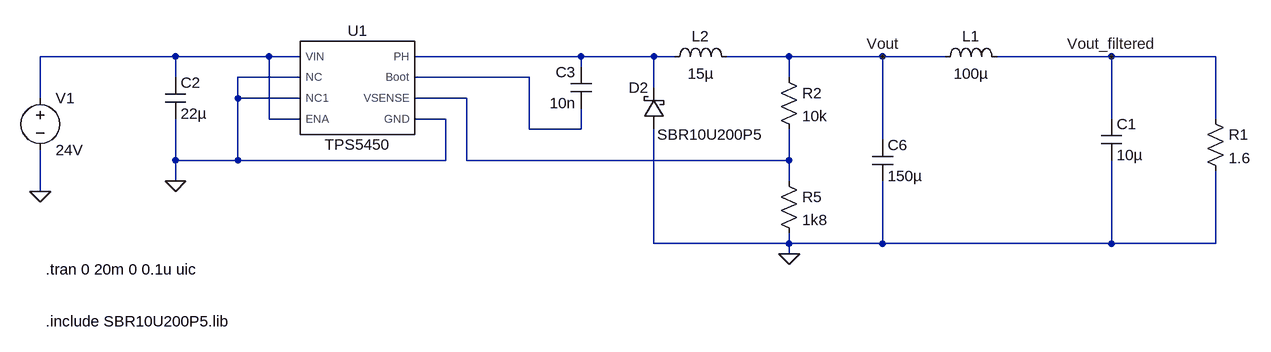
[diagram p0: schematic buck_24v_8v.asc]
buck_24v_8v.asc, the LTspice schematic file:
Version 4
SHEET 1 880 952
WIRE -1248 128 -1456 128
WIRE -1104 128 -1248 128
WIRE -1056 128 -1104 128
WIRE -624 128 -880 128
WIRE -512 128 -624 128
WIRE -480 128 -512 128
WIRE -304 128 -400 128
WIRE -160 128 -304 128
WIRE -64 128 -160 128
WIRE 192 128 16 128
WIRE 352 128 192 128
WIRE -624 144 -624 128
WIRE -1248 160 -1248 128
WIRE -1056 160 -1152 160
WIRE -704 160 -880 160
WIRE -304 160 -304 128
WIRE -512 176 -512 128
WIRE -1456 192 -1456 128
WIRE -1152 192 -1152 160
WIRE -1056 192 -1152 192
WIRE -800 192 -880 192
WIRE -1104 224 -1104 128
WIRE -1056 224 -1104 224
WIRE -832 224 -880 224
WIRE 192 224 192 128
WIRE 352 224 352 128
WIRE -704 240 -704 160
WIRE -624 240 -624 208
WIRE -624 240 -704 240
WIRE -160 256 -160 128
WIRE -1248 288 -1248 224
WIRE -1152 288 -1152 192
WIRE -1152 288 -1248 288
WIRE -832 288 -832 224
WIRE -832 288 -1152 288
WIRE -800 288 -800 192
WIRE -304 288 -304 240
WIRE -304 288 -800 288
WIRE -1248 320 -1248 288
WIRE -304 320 -304 288
WIRE -1456 336 -1456 272
WIRE -512 416 -512 240
WIRE -304 416 -304 400
WIRE -304 416 -512 416
WIRE -160 416 -160 320
WIRE -160 416 -304 416
WIRE 192 416 192 288
WIRE 192 416 -160 416
WIRE 352 416 352 304
WIRE 352 416 192 416
WIRE -304 432 -304 416
FLAG -1456 336 0
FLAG -1248 320 0
FLAG -304 432 0
FLAG -160 128 Vout
FLAG 192 128 Vout_filtered
SYMBOL voltage -1456 176 R0
WINDOW 123 0 0 Left 0
WINDOW 39 0 0 Left 0
SYMATTR InstName V1
SYMATTR Value 24V
SYMBOL cap -1264 160 R0
SYMATTR InstName C2
SYMATTR Value 22µ
SYMBOL cap -608 208 R180
WINDOW 0 24 56 Left 2
WINDOW 3 24 8 Left 2
SYMATTR InstName C3
SYMATTR Value 10n
SYMATTR SpiceLine Rser=78m
SYMBOL ind -496 144 R270
WINDOW 0 32 56 VTop 2
WINDOW 3 5 56 VBottom 2
SYMATTR InstName L2
SYMATTR Value 15µ
SYMATTR SpiceLine Rser=19m
SYMBOL res -320 144 R0
SYMATTR InstName R2
SYMATTR Value 10k
SYMBOL res -320 304 R0
SYMATTR InstName R5
SYMATTR Value 1k8
SYMBOL cap -176 256 R0
SYMATTR InstName C6
SYMATTR Value 150µ
SYMATTR SpiceLine Rser=35m
SYMBOL schottky -496 240 R180
WINDOW 0 24 64 Left 2
WINDOW 3 -152 -8 Left 2
SYMATTR InstName D2
SYMATTR Value SBR10U200P5
SYMATTR Description Diode
SYMATTR Type diode
SYMBOL TPS5450 -976 176 R0
SYMATTR InstName U1
SYMBOL res 336 208 R0
SYMATTR InstName R1
SYMATTR Value 1.6
SYMBOL ind -80 144 R270
WINDOW 0 32 56 VTop 2
WINDOW 3 5 56 VBottom 2
SYMATTR InstName L1
SYMATTR Value 100µ
SYMBOL cap 176 224 R0
SYMATTR InstName C1
SYMATTR Value 10µ
TEXT -1448 456 Left 2 !.tran 0 20m 0 0.1u uic
TEXT -1448 536 Left 2 !.include SBR10U200P5.lib

The netlist it stands for:
* buck_24v_8v.asc
V1 N001 0 24V
C2 N001 0 22µ
C3 N003 N002 10n Rser=78m
L2 N002 Vout 15µ Rser=19m
R2 Vout N004 10k
R5 N004 0 1k8
C6 Vout 0 150µ Rser=35m
D2 0 N002 SBR10U200P5
XU1 N001 0 0 N001 N002 N003 N004 0 TPS5450  ; pins VIN NC NC1 ENA PH Boot VSENSE GND
R1 Vout_filtered 0 1.6
L1 Vout Vout_filtered 100µ
C1 Vout_filtered 0 10µ
.model D D
.lib standard.dio
.tran 0 20m 0 0.1u uic
.include SBR10U200P5.lib
.lib TPS5450.LIB
.backanno
.end